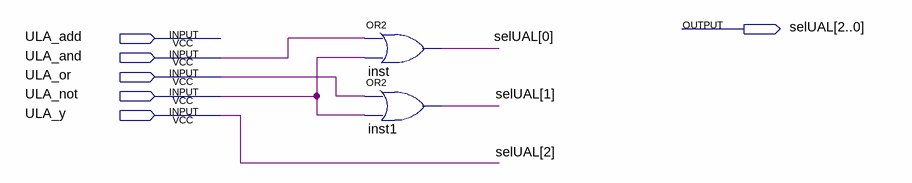
[diagram p0: schematic sheet]
// Quartus schematic coder.bdf as structural Verilog: 2 symbols, 6 pins
module coder (
  input  ULA_add,
  input  ULA_and,
  input  ULA_or,
  input  ULA_not,
  input  ULA_y,
  output [2:0] selUAL
);

  or inst (selUAL[0], ULA_and, ULA_not);
  or inst1 (selUAL[1], ULA_or, ULA_not);

  assign selUAL[2] = ULA_y;
endmodule
